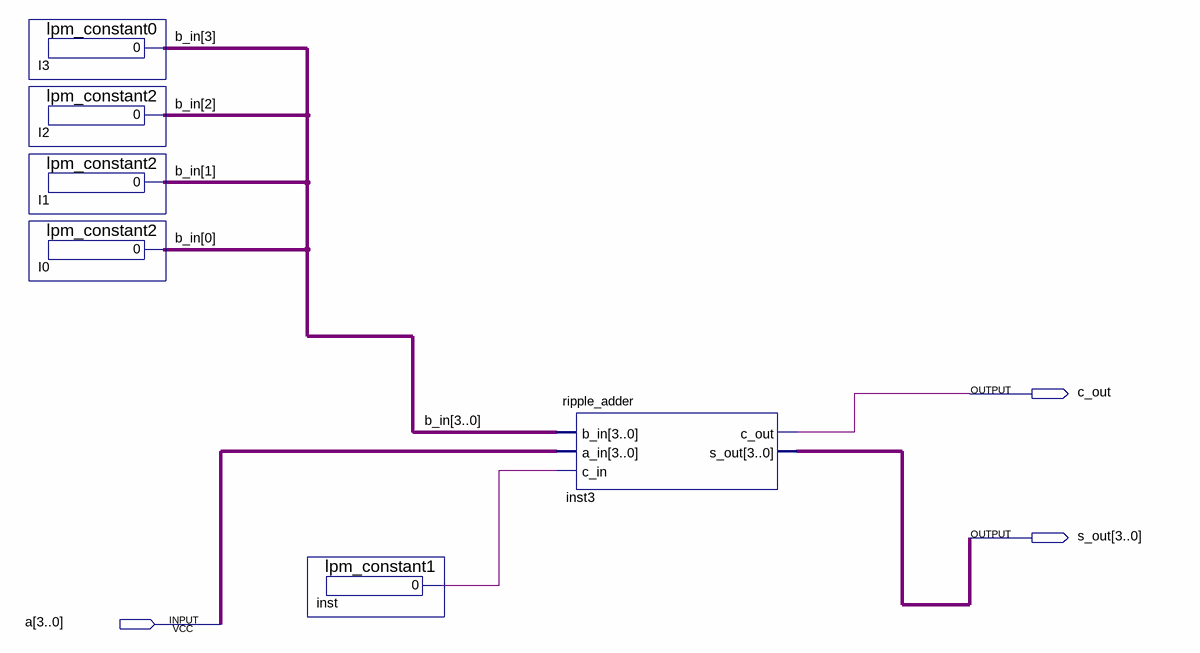
[diagram p0: schematic sheet]
// Quartus schematic part3.bdf as structural Verilog: 6 symbols, 3 pins
module part3 (
  input  [3:0] a,
  output c_out,
  output [3:0] s_out
);

  wire inst_result;
  wire [3:0] b_in;

  lpm_constant0 I3 (.result(b_in[3]));
  lpm_constant2 I2 (.result(b_in[2]));
  lpm_constant2 I1 (.result(b_in[1]));
  lpm_constant2 I0 (.result(b_in[0]));
  lpm_constant1 inst (.result(inst_result));
  ripple_adder inst3 (.b_in(b_in), .a_in(a), .c_in(inst_result), .c_out(c_out), .s_out(s_out));
endmodule
